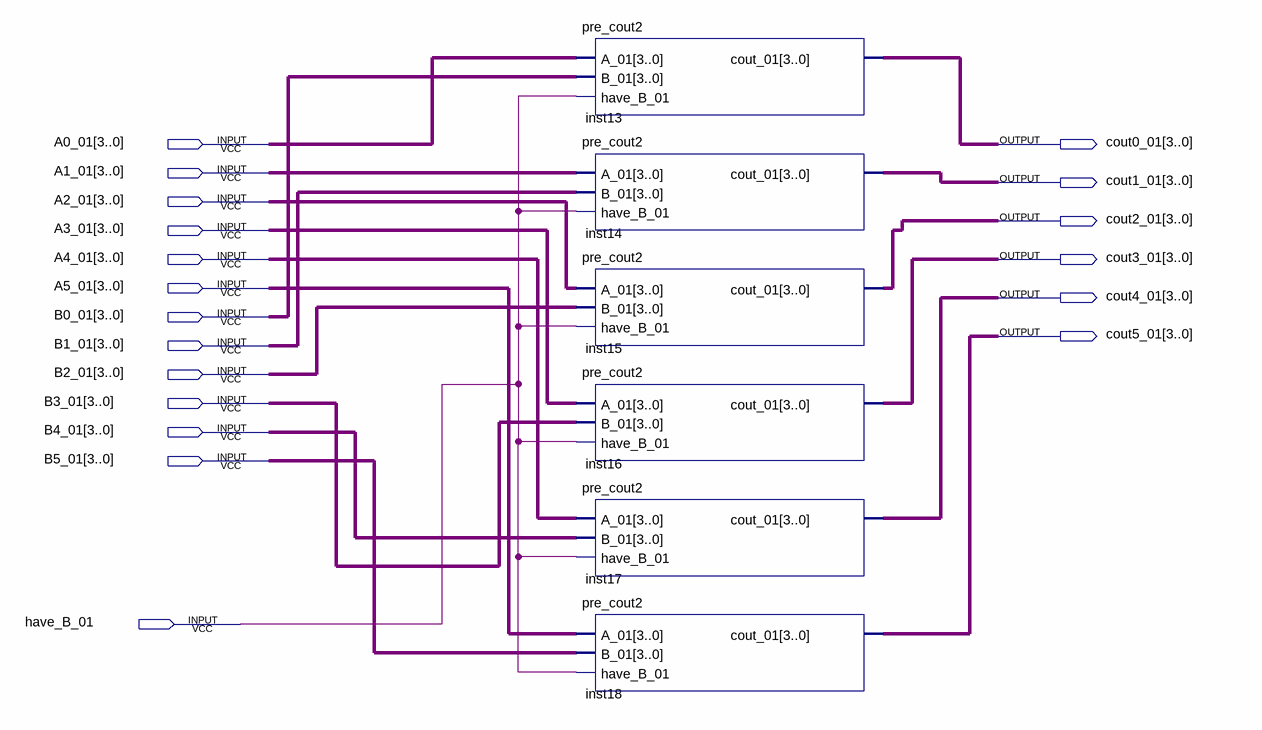
[diagram p0: schematic sheet]
// Quartus schematic pre_cout.bdf as structural Verilog: 6 symbols, 19 pins
module pre_cout (
  input  [3:0] A0_01,
  input  [3:0] A1_01,
  input  [3:0] A2_01,
  input  [3:0] A3_01,
  input  [3:0] A4_01,
  input  [3:0] A5_01,
  input  [3:0] B0_01,
  input  [3:0] B1_01,
  input  [3:0] B2_01,
  input  [3:0] B3_01,
  input  [3:0] B4_01,
  input  [3:0] B5_01,
  input  have_B_01,
  output [3:0] cout0_01,
  output [3:0] cout1_01,
  output [3:0] cout2_01,
  output [3:0] cout3_01,
  output [3:0] cout4_01,
  output [3:0] cout5_01
);

  pre_cout2 inst13 (.A_01(A0_01), .B_01(B0_01), .have_B_01(have_B_01), .cout_01(cout0_01));
  pre_cout2 inst14 (.A_01(A1_01), .B_01(B1_01), .have_B_01(have_B_01), .cout_01(cout1_01));
  pre_cout2 inst15 (.A_01(A2_01), .B_01(B2_01), .have_B_01(have_B_01), .cout_01(cout2_01));
  pre_cout2 inst16 (.A_01(A3_01), .B_01(B3_01), .have_B_01(have_B_01), .cout_01(cout3_01));
  pre_cout2 inst17 (.A_01(A4_01), .B_01(B4_01), .have_B_01(have_B_01), .cout_01(cout4_01));
  pre_cout2 inst18 (.A_01(A5_01), .B_01(B5_01), .have_B_01(have_B_01), .cout_01(cout5_01));
endmodule
